# Altium project lab3.2.PrjPcb
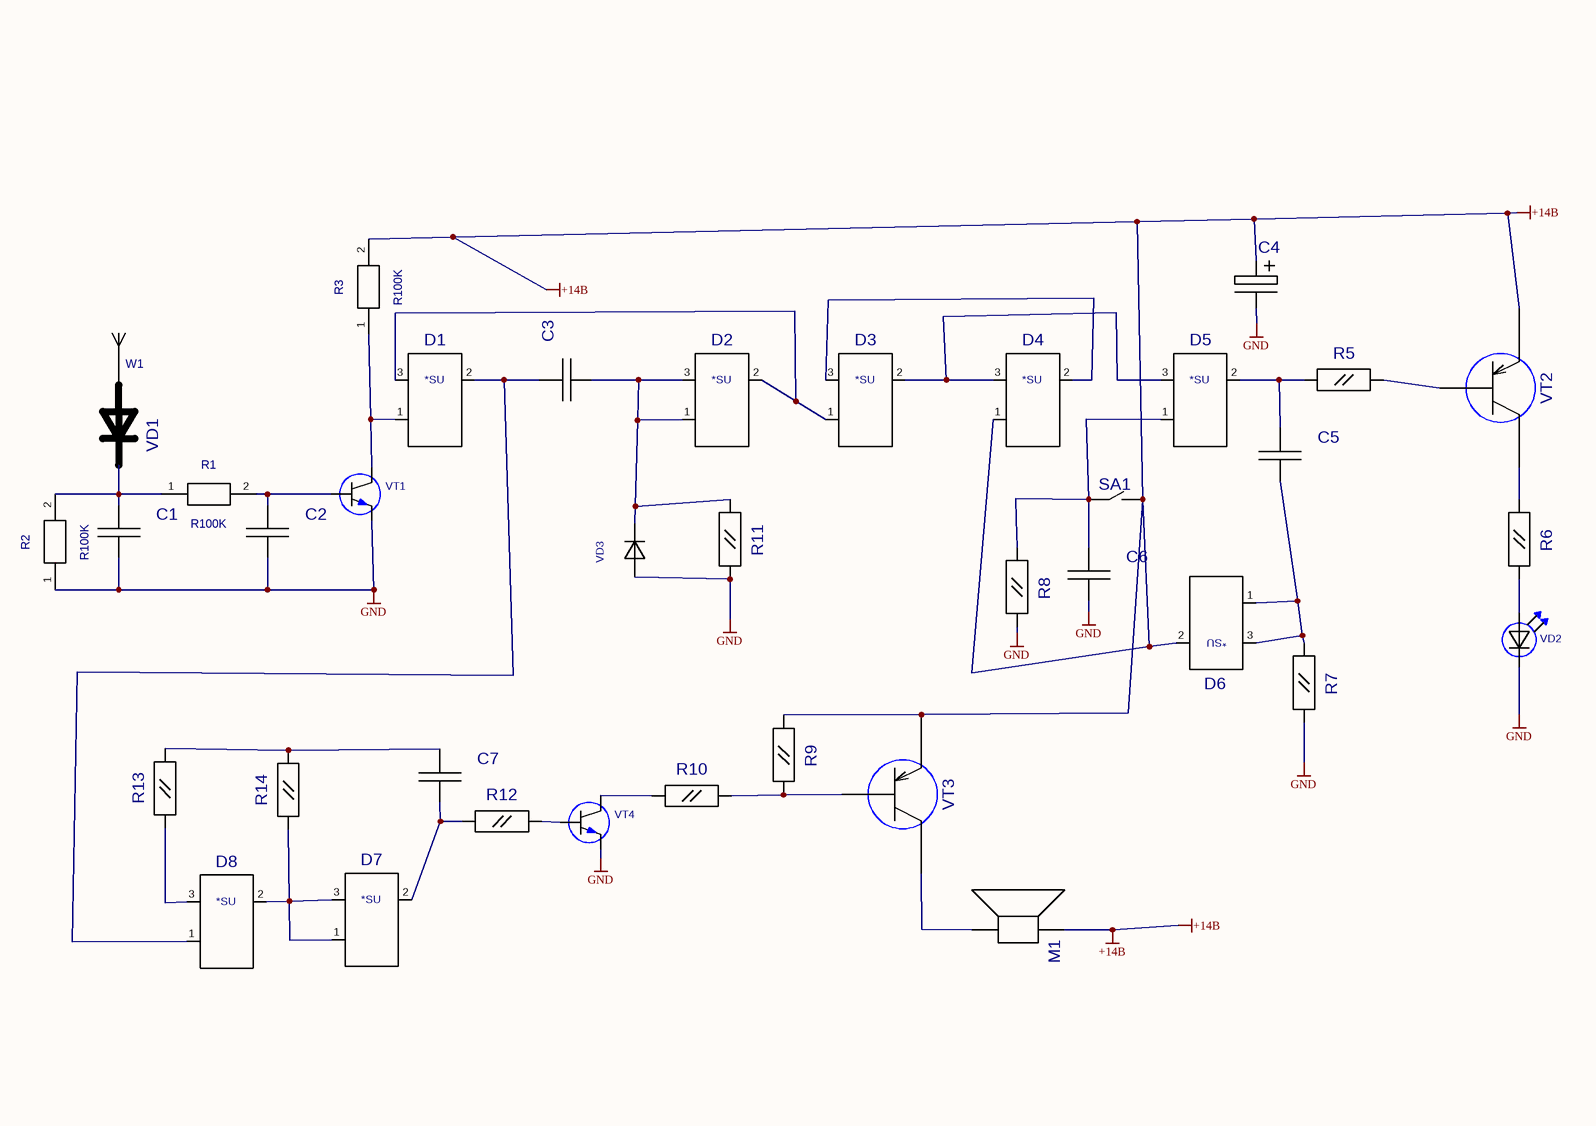
[diagram p0: Sheet1.SCHDOC]
1 sheet, 38 parts. Net scope: global (net labels, ports and power ports of the same name join across sheets).

## Sheet Sheet1.SCHDOC
size 297 x 209 mm; SheetNumber: 1; SheetTotal: 1; DocumentName: Sheet1.SCHDOC

### Parts
C1  B32921-C3103-0,01UF  [B32921(13X4)]  (value not drawn)
C2  B32921-C3103-0,01UF  [B32921(13X4)]  (value not drawn)
C3  B32921-C3103-0,01UF  [B32921(13X4)]  (value not drawn)
C4  B43505-470МКФ-400В-3550  [B43505-3550]  (value not drawn)
C5  B32921-C3103-0,01UF  [B32921(13X4)]  (value not drawn)
C6  B32921-C3103-0,01UF  [B32921(13X4)]  (value not drawn)
C7  B32921-C3103-0,01UF  [B32921(13X4)]  (value not drawn)
D1  142EN12  [KR142EN]  (value not drawn)
D2  142EN12  [KR142EN]  (value not drawn)
D3  142EN12  [KR142EN]  (value not drawn)
D4  142EN12  [KR142EN]  (value not drawn)
D5  142EN12  [KR142EN]  (value not drawn)
D6  142EN12  [KR142EN]  (value not drawn)
D7  142EN12  [KR142EN]  (value not drawn)
D8  142EN12  [KR142EN]  (value not drawn)
M1  МКЭ-332  [МКЭ-332]  (value not drawn)
R1  R100K  [R100]
R2  R100K  [R100]
R3  R100K  [R100]
R5  C2-33H-0.125W_OLD_UGO  [C2-33H-0.125W]  (value not drawn)
R6  C2-33H-0.125W_OLD_UGO  [C2-33H-0.125W]  (value not drawn)
R7  C2-33H-0.125W_OLD_UGO  [C2-33H-0.125W]  (value not drawn)
R8  C2-33H-0.125W_OLD_UGO  [C2-33H-0.125W]  (value not drawn)
R9  C2-33H-0.125W_OLD_UGO  [C2-33H-0.125W]  (value not drawn)
R10  C2-33H-0.125W_OLD_UGO  [C2-33H-0.125W]  (value not drawn)
R11  C2-33H-0.125W_OLD_UGO  [C2-33H-0.125W]  (value not drawn)
R12  C2-33H-0.125W_OLD_UGO  [C2-33H-0.125W]  (value not drawn)
R13  C2-33H-0.125W_OLD_UGO  [C2-33H-0.125W]  (value not drawn)
R14  C2-33H-0.125W_OLD_UGO  [C2-33H-0.125W]  (value not drawn)
SA1  8AS9M2RE  [8AS9M2RE]  (value not drawn)
VD1  1N4003  [DO-41(DO-204AL)]  (value not drawn)
VD2  LEAD  [HL5]  (value not drawn)
VD3  D-6  [D6]  (value not drawn)
VT1  BC168  [TO-92]  (value not drawn)
VT2  1Т320А  [ГТ320Б]  (value not drawn)
VT3  1Т320А  [ГТ320Б]  (value not drawn)
VT4  BC168  [TO-92]  (value not drawn)
W1  TELESKOP_ANTENNA  [TELESKOP_ANTENNA]  (value not drawn)

### Nets
+14B: C4.1 D4.1(Upr) D6.2(OUT0) M1.1(I/O1) R3.2 R9.1 SA1.1 VT2.1(E) VT3.1(E)
GND: C1.2 C2.2 C4.2 C6.2 R2.1 R7.2 R8.2 R11.2 VD2.2 VD3.1 VT1.2 VT4.2
NetC1_1: C1.1 R1.1 R2.2 VD1.K
NetC2_1: C2.1 R1.2 VT1.3
NetC3_1: C3.1 D1.2(OUT0) D8.1(Upr)
NetC3_2: C3.2 D2.1(Upr) D2.3(IN0) R11.1 VD3.2
NetC5_1: C5.1 D5.2(OUT0) R5.1
NetC5_2: C5.2 D6.1(Upr) D6.3(IN0) R7.1
NetC6_1: C6.1 D5.1(Upr) R8.1 SA1.2
NetC7_1: C7.1 R13.2 R14.2
NetC7_2: C7.2 D7.2(OUT0) R12.1
NetD1_1: D1.1(Upr) R3.1 VT1.1
NetD1_3: D1.3(IN0) D2.2(OUT0) D3.1(Upr)
NetD3_2: D3.2(OUT0) D4.3(IN0) D5.3(IN0)
NetD3_3: D3.3(IN0) D4.2(OUT0)
NetD7_1: D7.1(Upr) D7.3(IN0) D8.2(OUT0) R14.1
NetD8_3: D8.3(IN0) R13.1
NetM1_2: M1.2(I/O2) VT3.2(K)
NetR5_2: R5.2 VT2.3(B)
NetR6_1: R6.1 VT2.2(K)
NetR6_2: R6.2 VD2.1
NetR9_2: R9.2 R10.2 VT3.3(B)
NetR10_1: R10.1 VT4.1
NetR12_2: R12.2 VT4.3
NetVD1_A: VD1.A W1.1

Not connected (* = marked no-connect by the designer): C4 3

### Notes on the sheet
- (in symbol 142EN12) *SU

### Library data of the parts
R5-R14 = C2-33H-0.125W_OLD_UGO: Autor: pcbdesigner.ru; Value: *
C1-C3 C5-C7 = B32921-C3103-0,01UF: Value: *
C4 = B43505-470МКФ-400В-3550: Value: *
D1-D8 = 142EN12: Value: *
M1 = МКЭ-332: Value: *
R1-R3 = R100K: Value: *
SA1 = 8AS9M2RE: Value: *; Author: pcbdesigner.ru
VD1 = 1N4003: Value: *
VT2 VT3 = 1Т320А: Value: *
W1 = TELESKOP_ANTENNA: Value: *; Author: pcbdesigner.ru